# Altium schematic sheet ACPowerDistributionConnectors.SchDoc
size A4; SheetNumber: 1; SheetTotal: 5
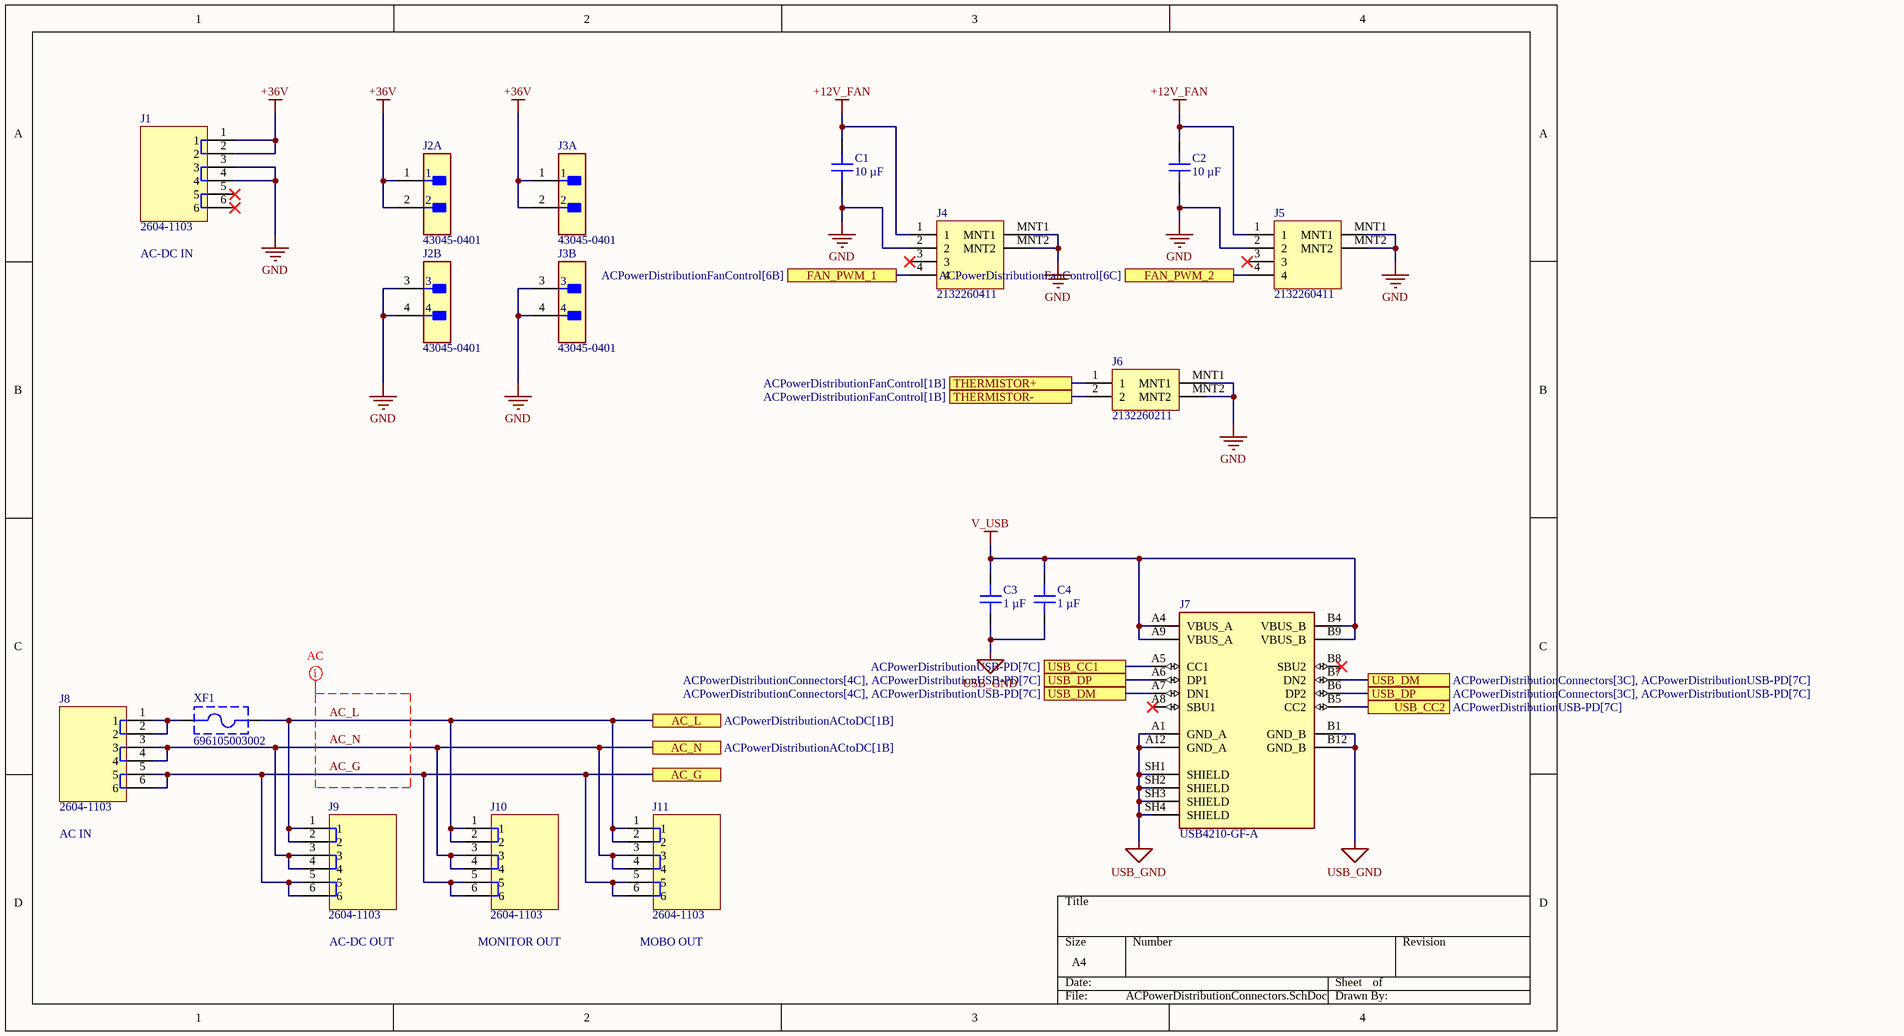
[diagram p0: ACPowerDistributionConnectors.SchDoc]

## Parts
C1  10 µF  [CAP 1210_3225 - 1MM]
C2  10 µF  [CAP 1210_3225 - 1MM]
C3  1 µF  [CAP 0603_1608]
C4  1 µF  [CAP 0603_1608]
J1  2604-1103  [2604-1103]
J2  43045-0401  [FP-43045-0401-MFG]  (parts A,B of 2)
J3  43045-0401  [FP-43045-0401-MFG]  (parts A,B of 2)
J4  2132260411  [2132260411]
J5  2132260411  [2132260411]
J6  2132260211  [2132260211]
J7  USB4210-GF-A  [USB4210-GF-A]
J8  2604-1103  [2604-1103]
J9  2604-1103  [2604-1103]
J10  2604-1103  [2604-1103]
J11  2604-1103  [2604-1103]
XF1  696105003002  [696105003002]

## Ports
AC_G, AC_L (see ACPowerDistributionACtoDC[1B]), AC_N (see ACPowerDistributionACtoDC[1B]), FAN_PWM_1 (see ACPowerDistributionFanControl[6B]), FAN_PWM_2 (see ACPowerDistributionFanControl[6C]), THERMISTOR+ (see ACPowerDistributionFanControl[1B]), THERMISTOR- (see ACPowerDistributionFanControl[1B]), USB_CC1 (see ACPowerDistributionUSB-PD[7C]), USB_CC2 (see ACPowerDistributionUSB-PD[7C]), USB_DM (see ACPowerDistributionConnectors[3C], ACPowerDistributionUSB-PD[7C]), USB_DM (see ACPowerDistributionConnectors[4C], ACPowerDistributionUSB-PD[7C]), USB_DP (see ACPowerDistributionConnectors[3C], ACPowerDistributionUSB-PD[7C]), USB_DP (see ACPowerDistributionConnectors[4C], ACPowerDistributionUSB-PD[7C])

## Nets
+12V_FAN: C1.2 C2.2 J4.1 J5.1
+36V: J1.1 J1.2 J2.1 J2.2 J3.1 J3.2
GND: C1.1 C2.1 J1.3 J1.4 J2.3 J2.4 J3.3 J3.4 J4.2 J4.MNT1 J4.MNT2 J5.2 J5.MNT1 J5.MNT2 J6.MNT1 J6.MNT2
USB_GND: C3.1 C4.1 J7.A1(GND_A) J7.A12(GND_A) J7.B1(GND_B) J7.B12(GND_B) J7.SH1(SHIELD) J7.SH2(SHIELD) J7.SH3(SHIELD) J7.SH4(SHIELD)
V_USB: C3.2 C4.2 J7.A4(VBUS_A) J7.A9(VBUS_A) J7.B4(VBUS_B) J7.B9(VBUS_B)
AC_G: J8.5 J8.6 J9.5 J9.6 J10.5 J10.6 J11.5 J11.6 ; port AC_G
AC_L: J9.1 J9.2 J10.1 J10.2 J11.1 J11.2 XF1.2 ; port AC_L
AC_N: J8.3 J8.4 J9.3 J9.4 J10.3 J10.4 J11.3 J11.4 ; port AC_N
FAN_PWM_1: J4.4 ; port FAN_PWM_1
FAN_PWM_2: J5.4 ; port FAN_PWM_2
THERMISTOR+: J6.1 ; port THERMISTOR+
THERMISTOR-: J6.2 ; port THERMISTOR-
USB_CC1: J7.A5(CC1) ; port USB_CC1
USB_CC2: J7.B5(CC2) ; port USB_CC2
USB_DM: J7.A7(DN1) J7.B7(DN2) ; port USB_DM
USB_DP: J7.A6(DP1) J7.B6(DP2) ; port USB_DP
NetJ8_1: J8.1 J8.2 XF1.1

Not connected (* = marked no-connect by the designer): J1 5* 6*; J4 3*; J5 3*; J7 A8(SBU1)* B8(SBU2)*

## Layout directives
net class AC: AC_G, AC_L, AC_N

## Notes on the sheet
- (near J1) AC-DC IN
- AC IN
- (near J9) AC-DC OUT
- (near J10) MONITOR OUT
- (near J11) MOBO OUT

## Library data of the parts
C1 C2 = CGA6P1X7R1N106K250AC: CAP CER 10UF 75V X7R 1210; manufacturer: TDK Corporation; Tolerance: ±10%; Part Number: CGA6P1X7R1N106K250AC; Value: 10 µF; Applications: Automotive; Capacitance: 10 µF; componentlink1description: Datasheet; componentlink1url: https://product.tdk.com/info/en/catalog/datasheets/mlcc_automotive_general_en.pdf?ref_disty=digikey; componentlink2description: DigiKey Link; componentlink2url: https://www.digikey.com/en/products/detail/tdk-corporation/CGA6P1X7R1N106K250AC/10240635; Device Package: 1210 (3225 Metric); lastupdated: 6/4/2024 7:21:00 PM; Lifecycle Status: Active; Minimum Order: 1; Mounting Type: Surface Mount, MLCC; Operating Temperature: -55°C ~ 125°C; Package / Case: 1210 (3225 Metric); packaging: TapeAndReel; partid: 40572; Part Status: Active; price: 0.30; series: CGA; Size / Dimension: 0.126" L x 0.098" W (3.20mm x 2.50mm); Supplier 1: DigiKey; Supplier Part Number 1: 445-181658-1-ND; Temperature Coefficient: X7R; Thickness (Max): 0.110" (2.80mm); Voltage - Rated: 75V; Features: Low ESL; Ratings: AEC-Q200
C3 C4 = CL10A105KA8NNNC: CAP CER 1UF 25V X5R 0603; manufacturer: Samsung Electro-Mechanics; Tolerance: ±10%; Part Number: CL10A105KA8NNNC; Capacitance: 1 µF; Applications: General Purpose; componentlink1description: Datasheet; componentlink1url: http://www.samsungsem.com/kr/support/product-search/mlcc/CL10A105KA8NNNC.jsp; componentlink2description: DigiKey Link; componentlink2url: https://www.digikey.com/en/products/detail/samsung-electro-mechanics/CL10A105KA8NNNC/3886760; Device Package: 0603 (1608 Metric); lastupdated: 2/9/2024 8:10:26 PM; Lifecycle Status: Active; Minimum Order: 1; Mounting Type: Surface Mount, MLCC; Operating Temperature: -55°C ~ 85°C; Package / Case: 0603 (1608 Metric); packaging: TapeAndReel; partid: 5508; Part Status: Active; price: 0.01; series: CL; Size / Dimension: 0.063" L x 0.031" W (1.60mm x 0.80mm); Supplier 1: DigiKey; Supplier Part Number 1: 1276-1102-1-ND; Temperature Coefficient: X5R; Thickness (Max): 0.035" (0.90mm); value: 1 µF; Voltage - Rated: 25V
J2 J3 = CMP-04776-000440-1: MICROFIT 3.0 RA HDR W/TH DR 15AU; Row Spacing: 3mm; Max Current Rating: 5A; Gender: Male; Number of Contacts: 4; Voltage Rating: 250V; Max Voltage Rating (DC): 250.25kV; Glow Wire Compliant: Compliant; Contact Resistance: 10mR; System: Connector; RoHS Compliant: Yes; Max Operating Temperature: 105°C; Number of Rows: 2; Mount: Through Hole; Color: Black; Packaging: Tray; Series: 43045; Current Rating: 5A; Pitch: 3mm; Package Quantity: 2232; Depth: 12.2mm; Radiation Hardening: No; Height: 8.77mm; Contact Material: Brass; Length: 10.15mm; Contact Plating: Gold; Flammability Rating: UL94 V-0; Termination: Solder; Min Operating Temperature: -40°C; Housing Color: Black; Orientation: Right Angle; Number of Positions: 4; Case/Package: SMC; Number of Circuits: 4; Housing Material: Thermoplastic; Halogen Free: Low Halogen
XF1 = CMP-1502-00234-2: NexarPartId: 56808804; Voltage Rating (AC): 250V; Fuse Current: 10A; RoHS: Non-Compliant; REACH SVHC: Unknown; Packaging: Box; Mount: Through Hole
J1 J8-J11 = 2604-1103: Supplier 1: DigiKey; Supplier Part Number 1: 2946-2604-1103-ND
J4 J5 = 2132260411: Supplier 1: DigiKey; Supplier Part Number 1: 900-2132260411CT-ND
J6 = 2132260211: Supplier 1: DigiKey; Supplier Part Number 1: 900-2132260211CT-ND
J7 = USB4210-GF-A: Supplier 1: DigiKey; Supplier Part Number 1: 2073-USB4210-GF-ACT-ND